# EAGLE schematic MODULO CNY70 (EAGLE 8.6.0)
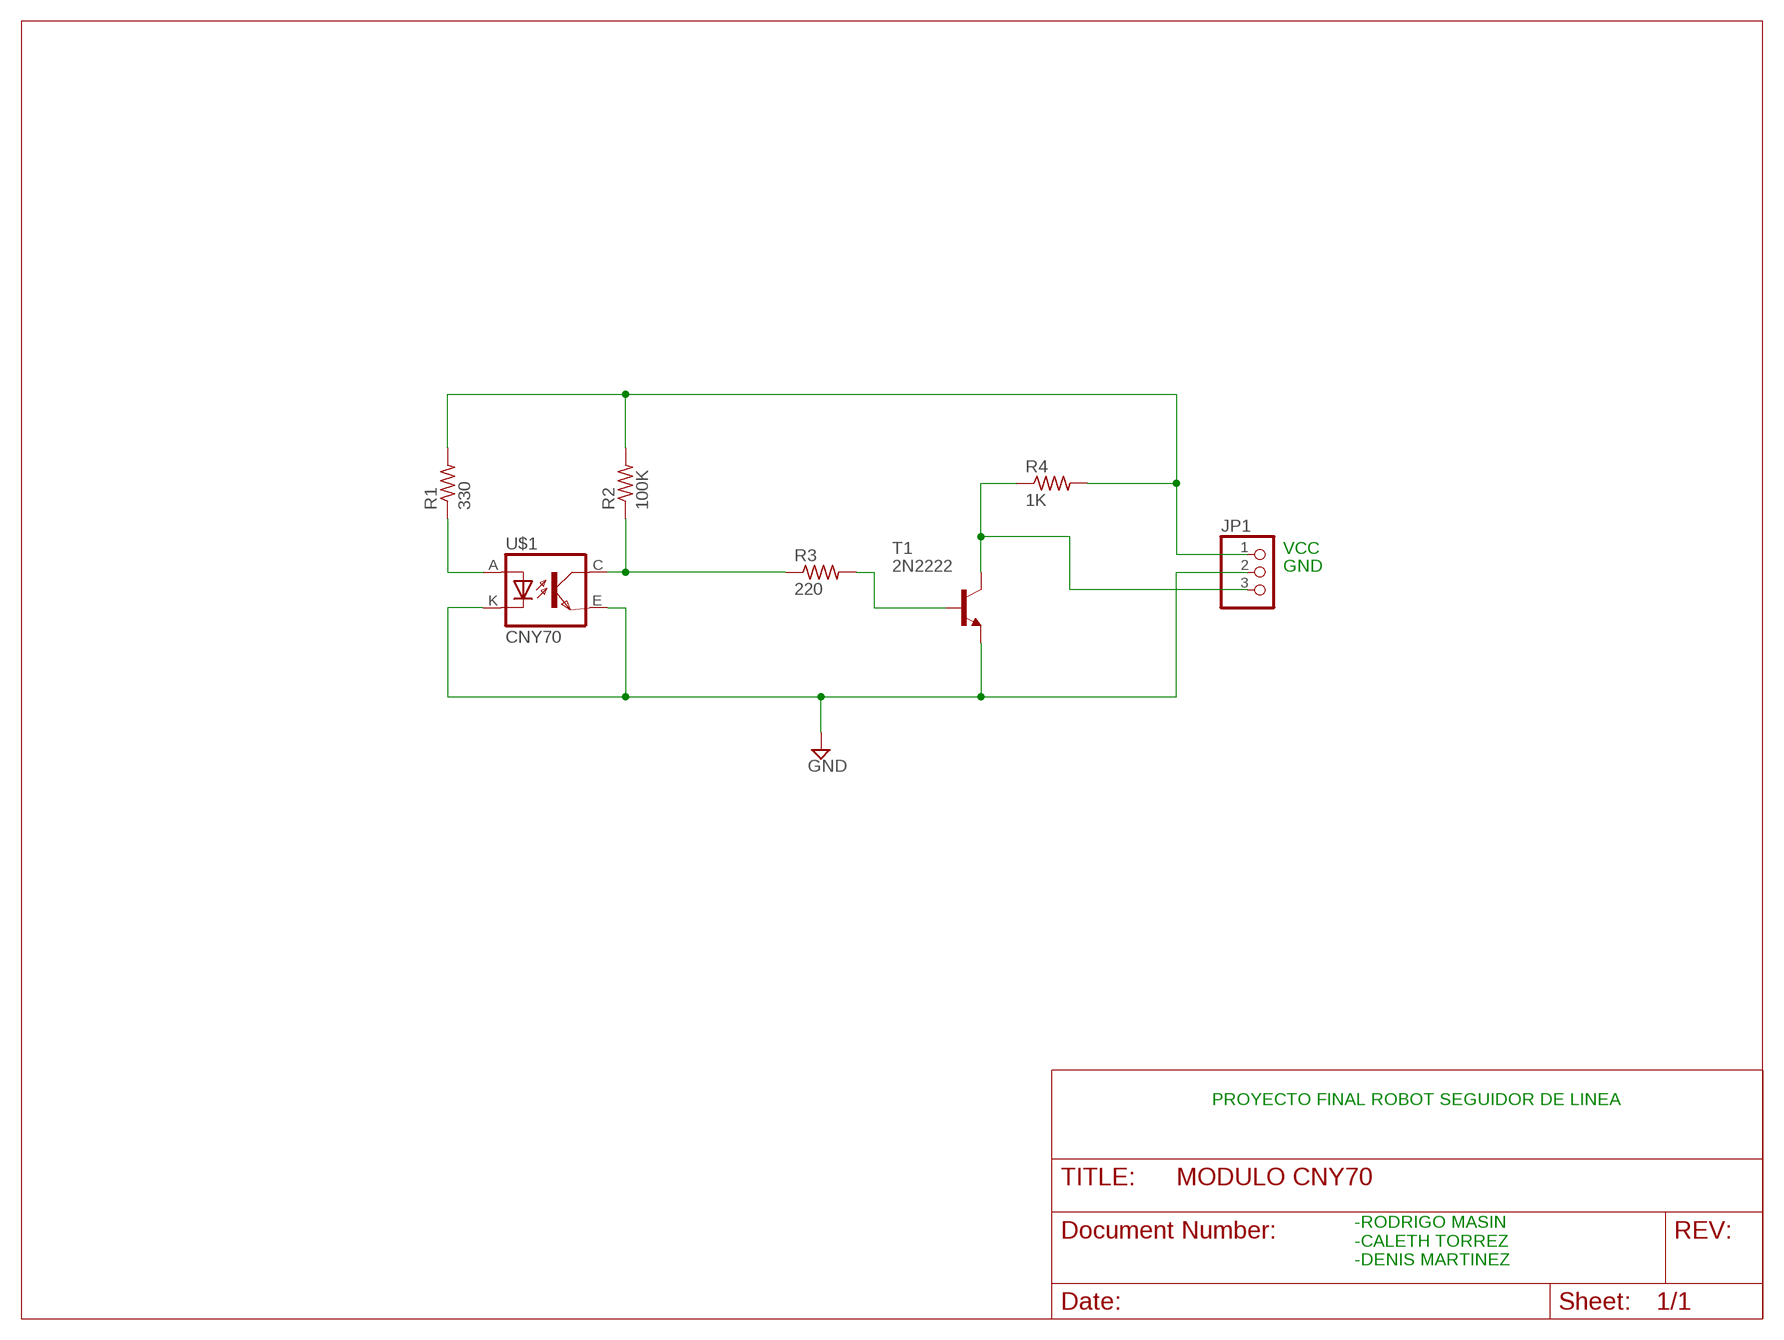
[diagram p0: schematic, sheet 1]

## Parts
JP1  PINHD-1X3  [1X03]
R1  330  R-US_0207/7  [0207/7]
R2  100K  R-US_0207/7  [0207/7]
R3  220  R-US_0207/7  [0207/7]
R4  1K  R-US_0207/7  [0207/7]
T1  2N2222  [TO18]
U$1  CNY70  [4]

## Nets
GND: JP1.2 T1.1(E) U$1.E(EMI) U$1.K(C)
N$1: R1.1 U$1.A
N$2: R2.1 R3.1 U$1.C(COL)
N$3: JP1.1 R1.2 R2.2 R4.2
N$5: R3.2 T1.2(B)
N$6: JP1.3 R4.1 T1.3(C)

## Notes on the sheet
- VCC
- GND
- PROYECTO FINAL ROBOT SEGUIDOR DE LINEA
- -RODRIGO MASIN
  -CALETH TORREZ
  -DENIS MARTINEZ

## Library data of the parts
JP1 = pinhead:PINHD-1X3: PIN HEADER
R1-R4 = rcl:R-US_: RESISTOR, American symbol; SPICEPREFIX: R
T1 = transistor:2N2222: NPN TRANSISTOR
U$1 = cny70:CNY70